# EAGLE design template1 (EAGLE 5.10)
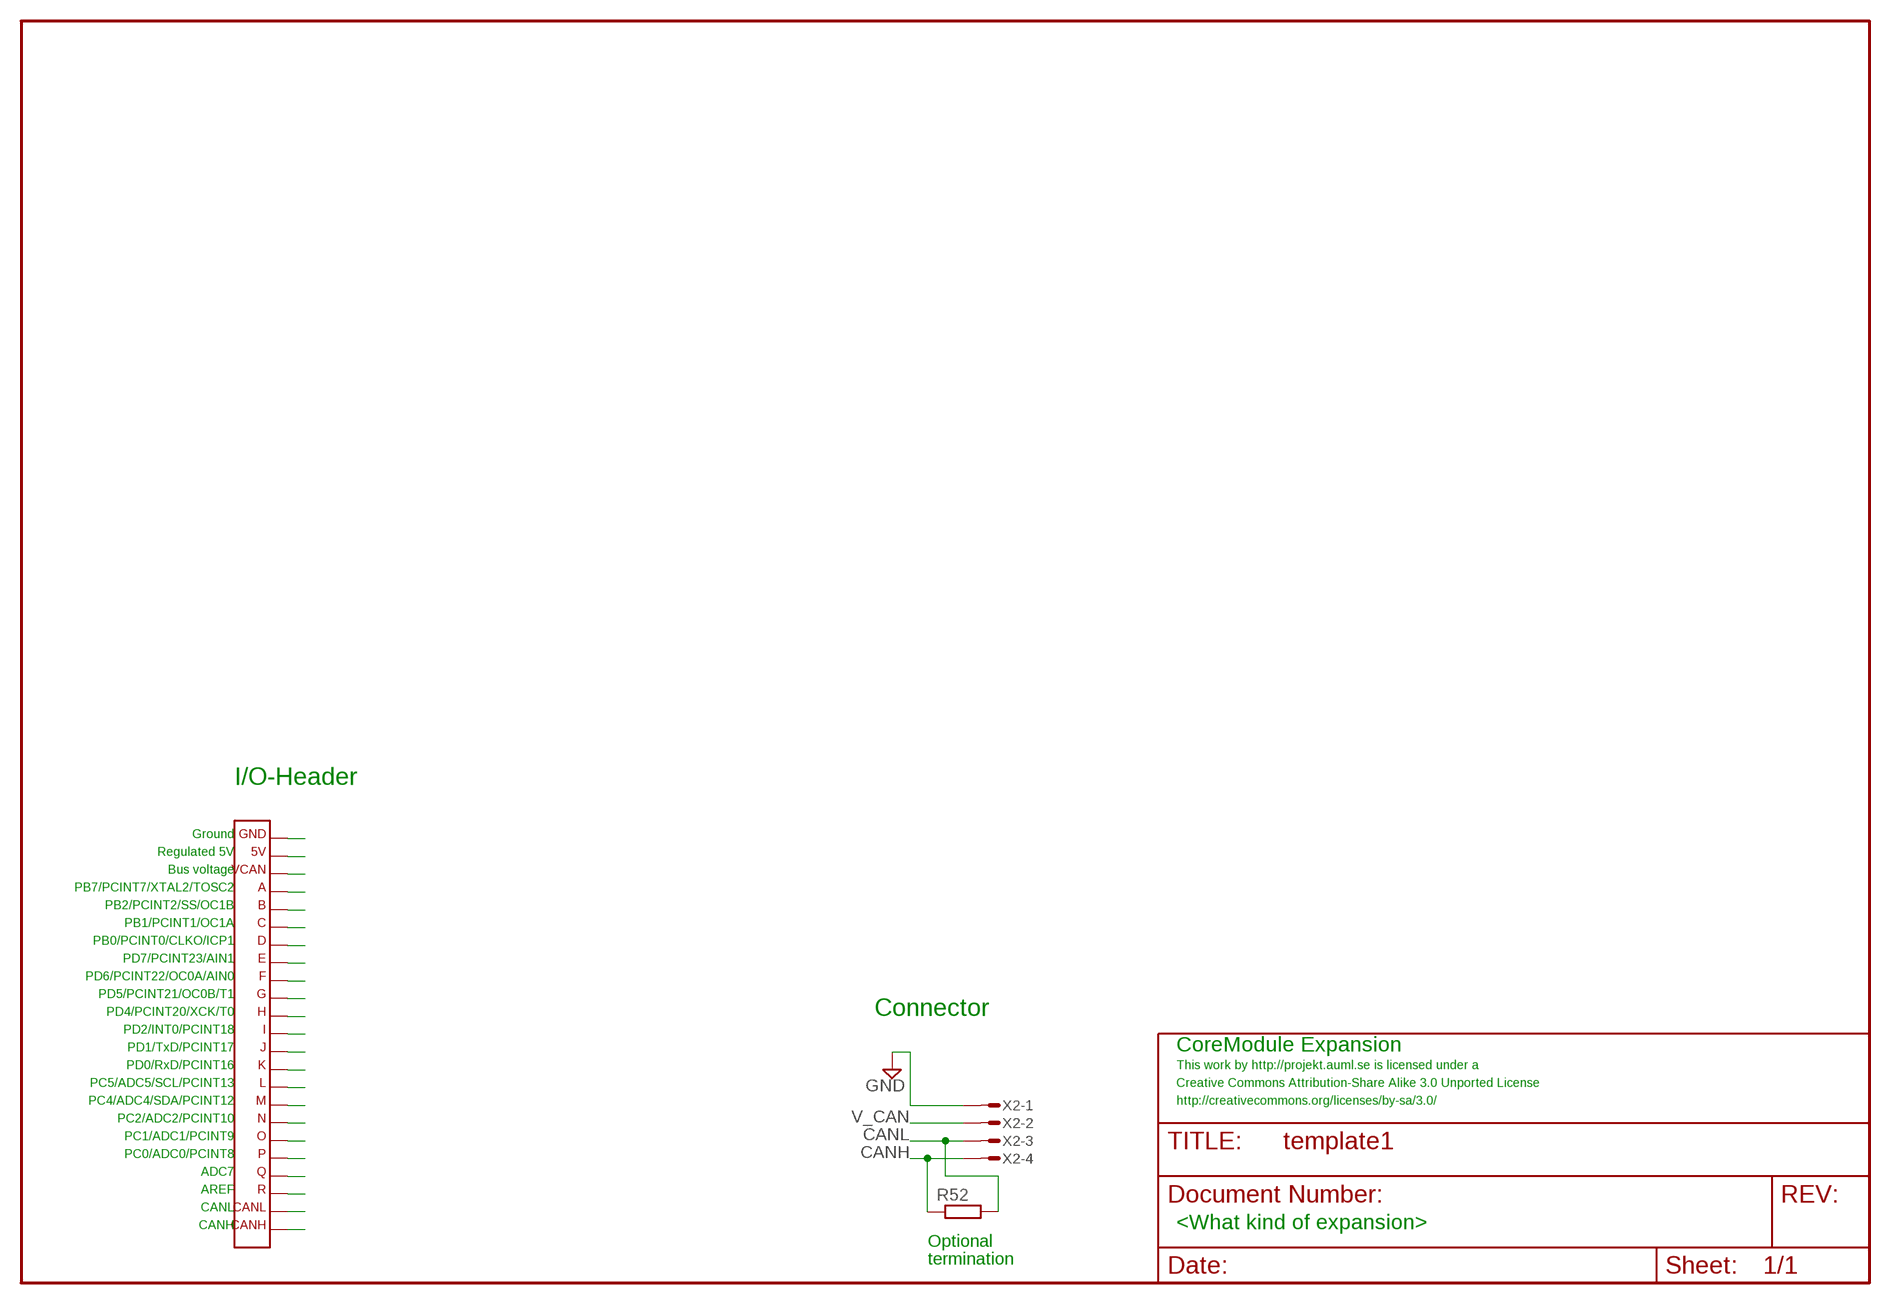
[diagram p0: schematic, sheet 1]

## Parts
R52  R-EUR0603  [R0603]
X1  CORETWO_LAYOUTISPHOLES_CU  [CORETWO_LAYOUT_ISPHOLES_CU]
X2  MICROMATCH-4  [MICROMATCH-4]

## Nets
CANH: R52.1 X1.CANH X2.4
CANL: R52.2 X1.CANL X2.3
EXP_A: X1.A
EXP_B: X1.B
EXP_C: X1.C
EXP_D: X1.D
EXP_E: X1.E
EXP_F: X1.F
EXP_G: X1.G
EXP_H: X1.H
EXP_I: X1.I
EXP_J: X1.J
EXP_K: X1.K
EXP_L: X1.L
EXP_M: X1.M
EXP_N: X1.N
EXP_O: X1.O
EXP_P: X1.P
EXP_Q: X1.Q
EXP_R: X1.R
GND: X1.GND X2.1
V_CAN: X1.VCAN X2.2
VCC: X1.5V

## Notes on the sheet
- I/O-Header
- Ground
- Regulated 5V
- Bus voltage
- PB7/PCINT7/XTAL2/TOSC2
- PB2/PCINT2/SS/OC1B
- PB1/PCINT1/OC1A
- PB0/PCINT0/CLKO/ICP1
- PD7/PCINT23/AIN1
- PD6/PCINT22/OC0A/AIN0
- PD5/PCINT21/OC0B/T1
- PD4/PCINT20/XCK/T0 | Connector
- PD2/INT0/PCINT18
- PD1/TxD/PCINT17 | CoreModule Expansion
- PD0/RxD/PCINT16 | This work by http://projekt.auml.se is licensed under a
- PC5/ADC5/SCL/PCINT13 | Creative Commons Attribution-Share Alike 3.0 Unported License
- PC4/ADC4/SDA/PCINT12 | http://creativecommons.org/licenses/by-sa/3.0/
- PC2/ADC2/PCINT10
- PC1/ADC1/PCINT9
- PC0/ADC0/PCINT8
- ADC7
- AREF
- CANL
- CANH | <What kind of expansion>
- Optional
- termination

## Library data of the parts
R52 = rcl:R-EU
X1 = expboard:CORETWO_LAYOUT
X2 = con-amp-micromatch:MICROMATCH-4: MicroMaTch 4 7-215464-4 / 0-215464-4 Drawing Number C-215464 DDEController.pdf

## Board
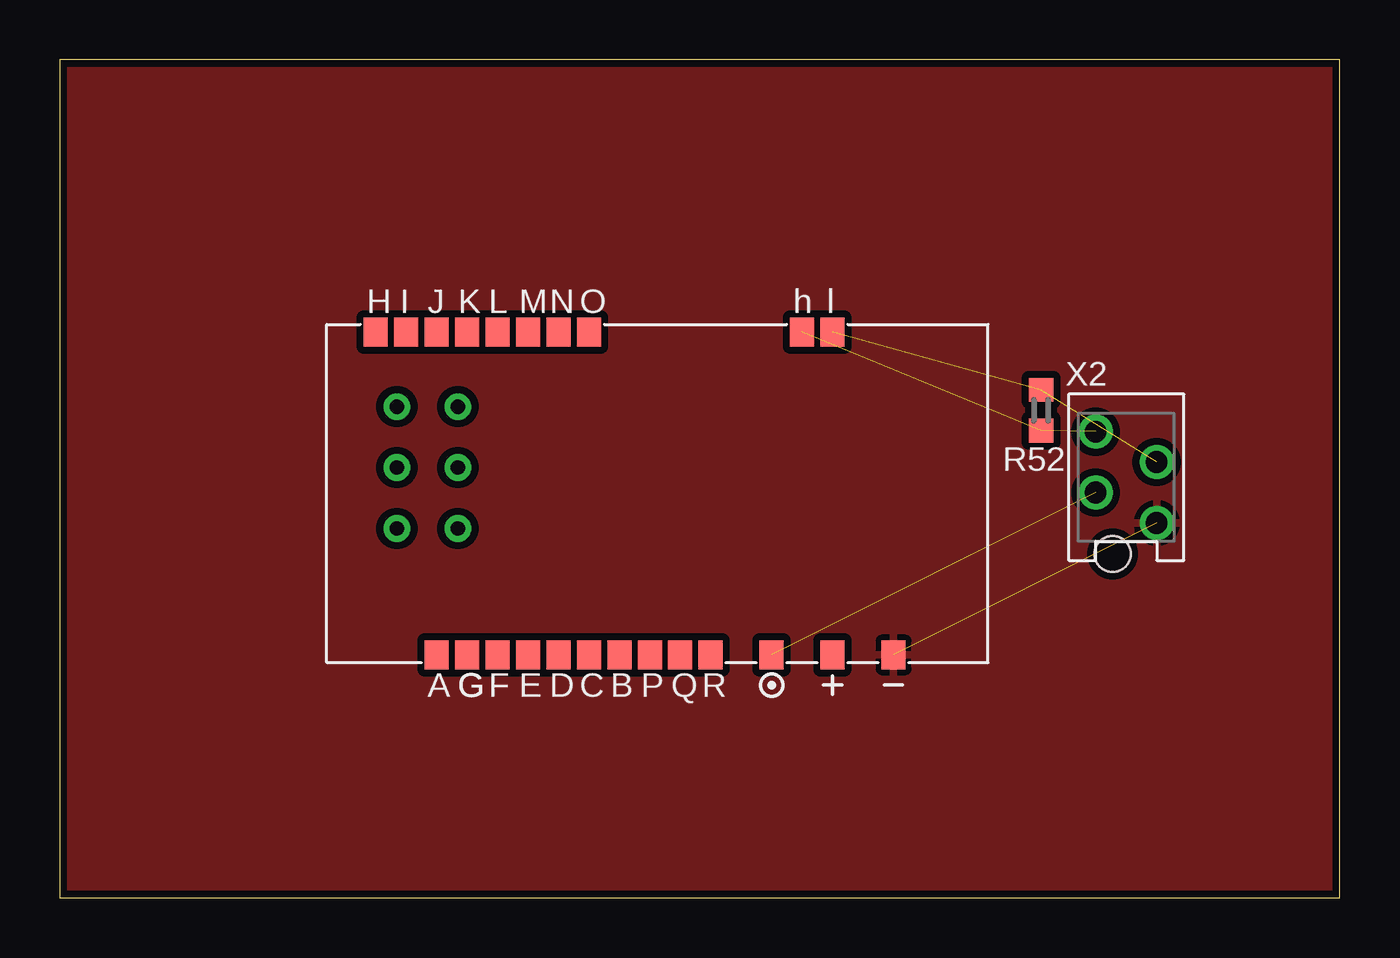
[diagram p1: board, top side]
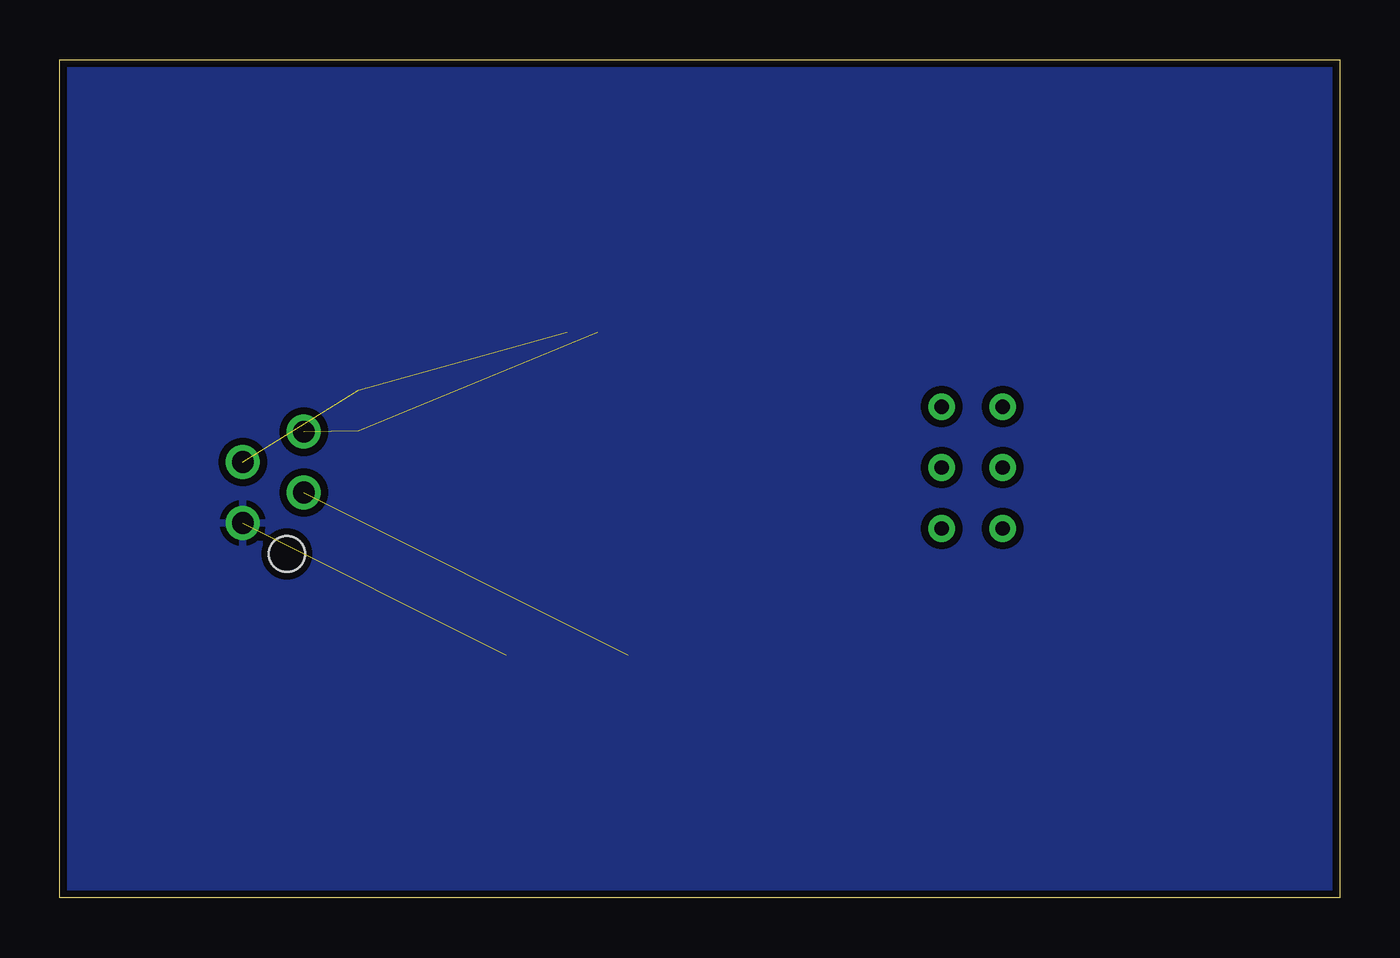
[diagram p2: board, bottom side, seen from below]

Size 53.34 x 34.92 mm. Coordinates in mm from the lower left corner, seen from the top.
Outline: 0,0 53.34,0 53.34,34.92 0,34.92 0,0
Copper layers (1*16): Top 0.035mm / dielectric 1.5mm / Bottom 0.035mm
Design rules "default": minimum track width 10mil, minimum drill 0.4mm, track to track 10mil, track to pad 10mil, pad to pad 10mil, via to via 10mil, smd to smd 8mil, copper to edge 10mil, drill to drill 8mil, minimum pad ring 10mil, minimum via ring 10mil, stop-mask expansion 4mil, vias tented up to drill 18mil, thermal gap 10mil

### Footprints (pad centres in the part's own frame; a part is rotated, then mirrored left to right if it is on the bottom)
R0603 = smd 0.991 x 1.016: 1 -0.85,0; 2 0.85,0
CORETWO_LAYOUT_ISPHOLES_CU = smd 1 x 1.2: 5V 7.315,-6.648; A -9.195,-6.648; B -1.575,-6.648; C -2.845,-6.648; CANH 6.045,6.814; CANL 7.315,6.814; D -4.115,-6.648; E -5.385,-6.648; F -6.655,-6.648; G -7.925,-6.648; GND 9.855,-6.648; H -11.735,6.814; I -10.465,6.814; J -9.195,6.814; K -7.925,6.814; L -6.655,6.814; M -5.385,6.814; N -4.115,6.814; O -2.845,6.814; P -0.305,-6.648; Q 0.965,-6.648; R 2.235,-6.648; VCAN 4.775,-6.648 | drill 0.6 round: P$1 -10.846,3.708; P$2 -8.306,3.708; P$3 -10.846,1.168; P$4 -8.306,1.168; P$5 -8.306,-1.372; P$6 -10.846,-1.372
MICROMATCH-4 = drill 0.9 round: 1 1.905,1.27; 2 0.635,-1.27; 3 -0.635,1.27; 4 -1.905,-1.27 | hole 1.5: 3.199,-0.562

### Placement (x,y rotation side)
R52  40.89,20.32 90 top
X1  24.89,16.76 0 top
X2  44.45,17.53 270 top

### Tracks (layer width: path | path; a pad name or v marks a point on that pad's centre or on a via)
CANH  (2 unrouted)
CANL  (2 unrouted)
GND  (1 unrouted)
  pour Bottom (isolate 0.305, rank 3): 0,34.92 53.34,34.92 53.34,0 0,0
  pour Top (isolate 0.305, rank 3): 0,34.92 53.34,34.92 53.34,0 0,0
V_CAN  (1 unrouted)

### Text on the board
Document: Creative Commons Attribution-Share Alike 3.0 Unported License | This work by http://projekt.auml.se is licensed under a | http://creativecommons.org/licenses/by-sa/3.0/